# EAGLE schematic ESP_v8 (EAGLE 7.6.0)
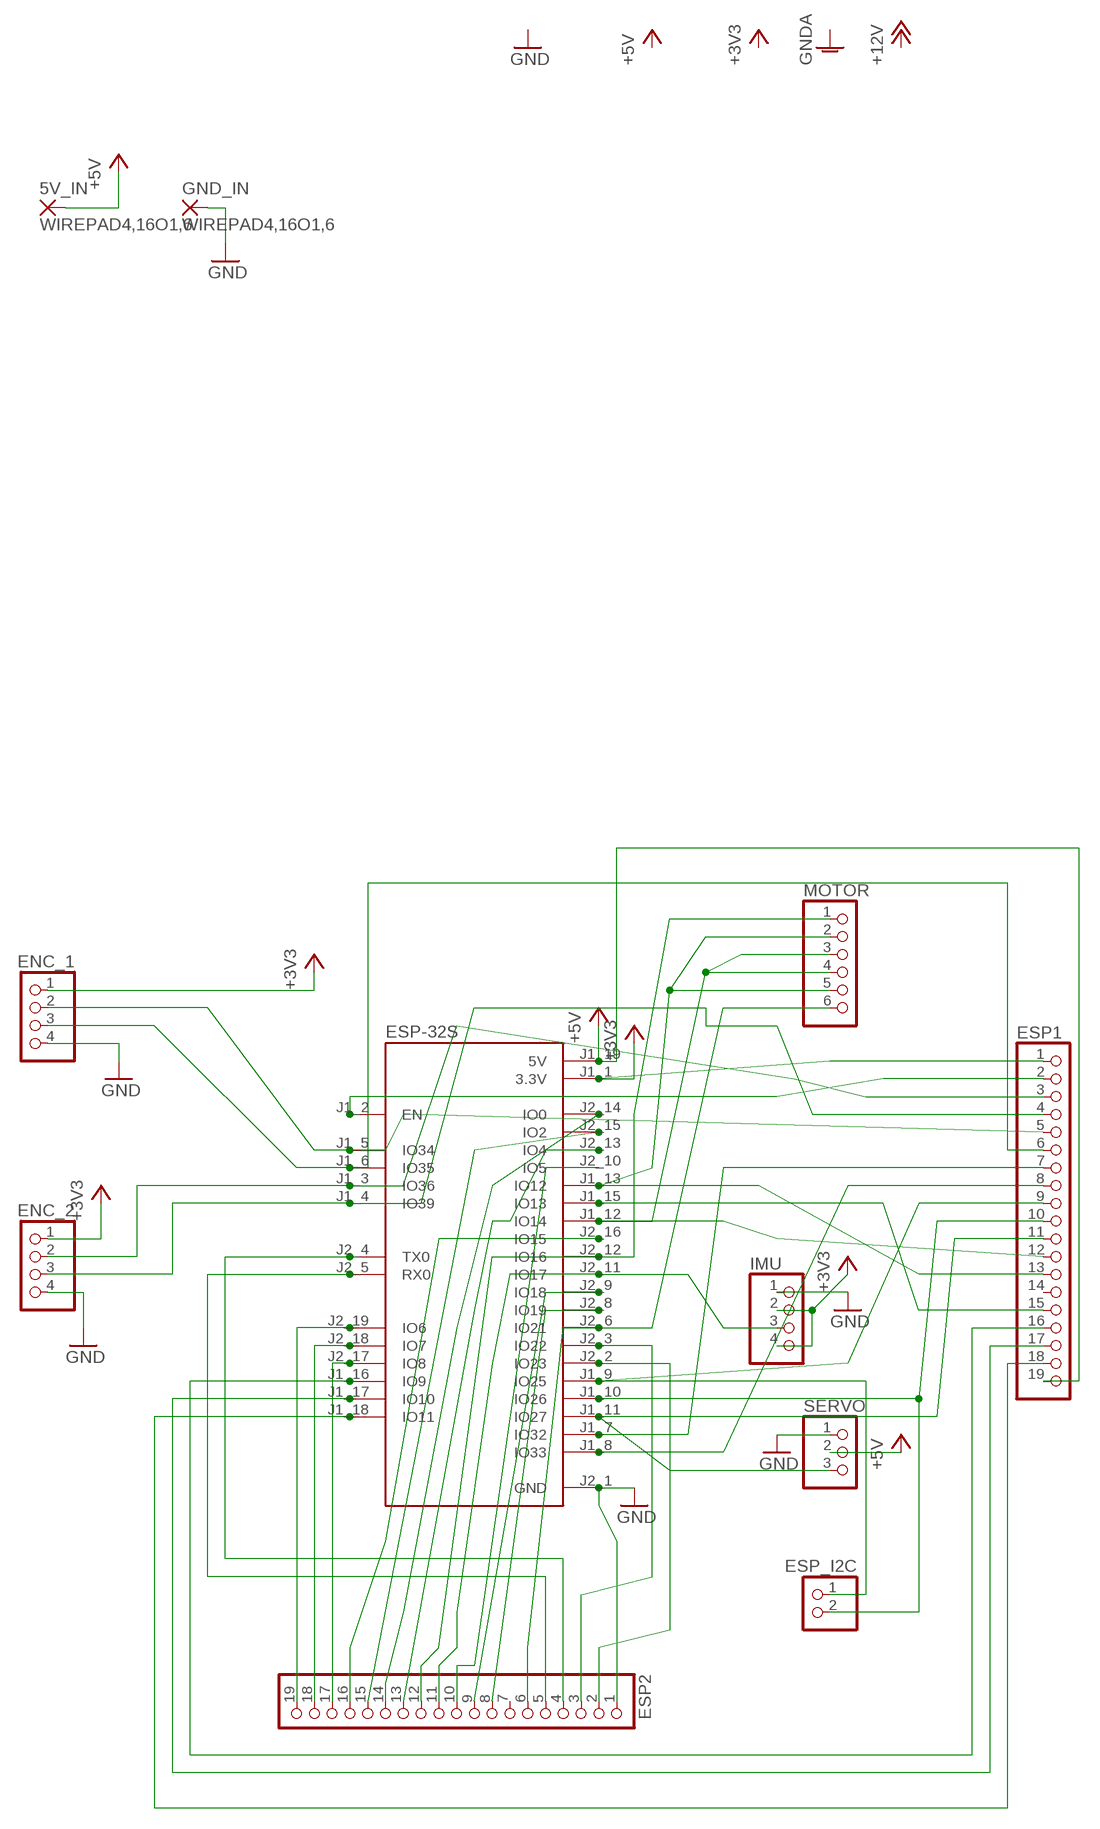
[diagram p0: schematic, sheet 1]

## Parts
5V_IN  WIREPAD4,16O1,6  [4,16O1,6]
ENC_1  PINHD-1X4  [1X04]
ENC_2  PINHD-1X4  [1X04]
ESP1  PINHD-1X19  [1X19]
ESP2  PINHD-1X19  [1X19]
ESP-32S  NODEMCU-32S  [MODULE_NODEMCU-32S]
ESP_I2C  PINHD-1X2  [1X02]
GND_IN  WIREPAD4,16O1,6  [4,16O1,6]
IMU  PINHD-1X4  [1X04]
MOTOR  PINHD-1X6  [1X06]
SERVO  PINHD-1X3  [1X03]

## Nets
+3V3: ENC_1.1 ENC_2.1 ESP1.1 ESP-32S.J1_1(3.3V) IMU.2 IMU.4
+5V: 5V_IN.1(P) ESP1.19 ESP-32S.J1_19(5V) SERVO.2
GND: ENC_1.4 ENC_2.4 ESP2.1 ESP-32S.J2_1(GND) GND_IN.1(P) IMU.1 SERVO.1
N$1: ESP1.11 ESP-32S.J1_11(IO27) SERVO.3
N$2: ESP2.12 ESP-32S.J2_12(IO16) MOTOR.1
N$3: ESP1.13 ESP-32S.J1_13(IO12) MOTOR.2 MOTOR.5
N$4: ESP1.12 ESP-32S.J1_12(IO14) MOTOR.3 MOTOR.4
N$5: ESP2.6 ESP-32S.J2_6(IO21) MOTOR.6
N$7: ENC_1.2 ESP1.5 ESP-32S.J1_5(IO34)
N$8: ESP2.11 ESP-32S.J2_11(IO17) IMU.3
N$10: ENC_2.3 ESP1.4 ESP-32S.J1_4(IO39)
N$11: ENC_2.2 ESP1.3 ESP-32S.J1_3(IO36)
N$13: ESP1.9 ESP-32S.J1_9(IO25) ESP_I2C.1
N$23: ESP1.15 ESP-32S.J1_15(IO13)
N$24: ESP1.7 ESP-32S.J1_7(IO32)
N$25: ESP2.14 ESP-32S.J2_14(IO0)
N$26: ESP2.15 ESP-32S.J2_15(IO2)
N$27: ESP2.13 ESP-32S.J2_13(IO4)
N$28: ESP1.8 ESP-32S.J1_8(IO33)
N$53: ESP2.16 ESP-32S.J2_16(IO15)
N$55: ESP2.8 ESP-32S.J2_8(IO19)
N$56: ESP2.3 ESP-32S.J2_3(IO22)
N$57: ESP2.2 ESP-32S.J2_2(IO23)
N$58: ESP1.2 ESP-32S.J1_2(EN)
N$59: ESP2.4 ESP-32S.J2_4(TX0)
N$60: ESP2.5 ESP-32S.J2_5(RX0)
N$61: ESP2.19 ESP-32S.J2_19(IO6)
N$62: ESP2.18 ESP-32S.J2_18(IO7)
N$63: ESP2.17 ESP-32S.J2_17(IO8)
N$64: ESP1.16 ESP-32S.J1_16(IO9)
N$65: ESP1.17 ESP-32S.J1_17(IO10)
N$66: ESP1.18 ESP-32S.J1_18(IO11)
N$67: ESP2.10 ESP-32S.J2_10(IO5)
N$68: ESP1.10 ESP-32S.J1_10(IO26) ESP_I2C.2
N$69: ENC_1.3 ESP1.6 ESP-32S.J1_6(IO35)
N$84: ESP2.9 ESP-32S.J2_9(IO18)
Unconnected: ESP1.14 ESP2.7

## Library data of the parts
5V_IN GND_IN = wirepad:WIREPAD: Wire PAD connect wire on PCB
ENC_1 ENC_2 IMU = pinhead:PINHD-1X4: PIN HEADER
ESP1 ESP2 = pinhead:PINHD-1X19: PIN HEADER
ESP-32S = NODEMCU-32S_fgy:NODEMCU-32S: Check availability <https://pricing.snapeda.com/parts/NODEMCU-32S/AI-Thinker/view-part?ref=eda>; AVAILABILITY: Not in stock; CHECK_PRICES: https://www.snapeda.com/parts/NODEMCU-32S/AI-Thinker/view-part/?ref=eda; DESCRIPTION: WIFI MODULE V1; MF: AI-Thinker; MP: NODEMCU-32S; PACKAGE: Package; PRICE: None; SNAPEDA_LINK: https://www.snapeda.com/parts/NODEMCU-32S/AI-Thinker/view-part/?ref=snap
ESP_I2C = pinhead:PINHD-1X2: PIN HEADER
MOTOR = pinhead:PINHD-1X6: PIN HEADER
SERVO = pinhead:PINHD-1X3: PIN HEADER